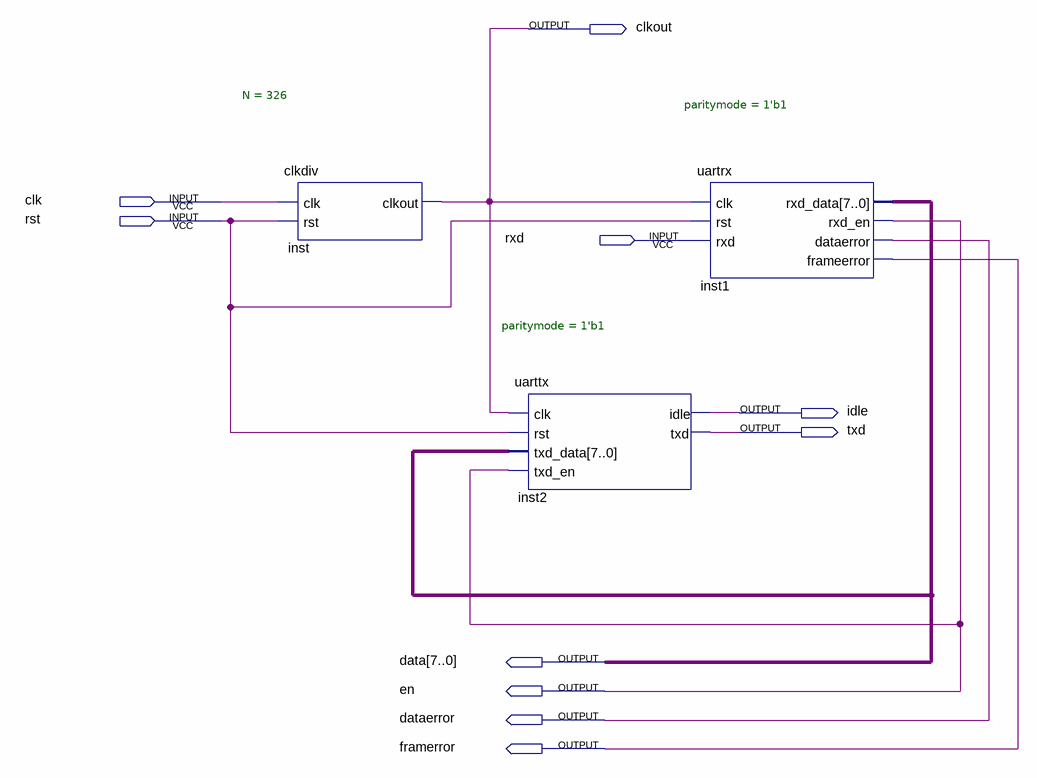
[diagram p0: schematic sheet]
// Quartus schematic uart_top.bdf as structural Verilog: 3 symbols, 10 pins
module uart_top (
  input  clk,
  input  rst,
  input  rxd,
  output clkout,
  output idle,
  output txd,
  output [7:0] data,
  output en,
  output dataerror,
  output framerror
);

  clkdiv #(.N(326)) inst (.clk(clk), .rst(rst), .clkout(clkout));
  uarttx #(.paritymode(1'b1)) inst2 (.clk(clkout), .rst(rst), .txd_data(data), .txd_en(en), .idle(idle), .txd(txd));
  uartrx #(.paritymode(1'b1)) inst1 (
    .clk(clkout), .rst(rst), .rxd(rxd), .rxd_data(data), .rxd_en(en), .dataerror(dataerror),
    .frameerror(framerror));
endmodule
